# EAGLE design battery_monitor (EAGLE 7.3.0)
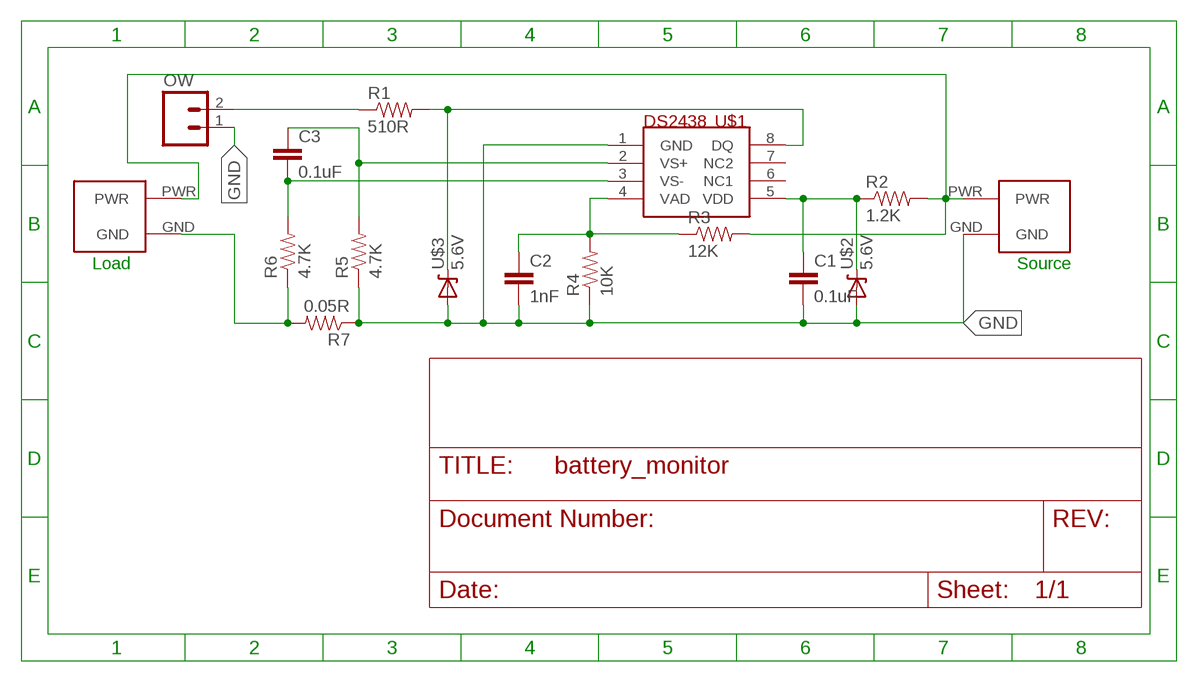
[diagram p0: schematic, sheet 1]

## Parts
C1  0.1uF  CAP0805  [0805]
C2  1nF  CAP0805  [0805]
C3  0.1uF  CAP0805  [0805]
LOAD  AND_PWR  [AND_PWR]
OW  M02POLAR_LOCK  [MOLEX-1X2_LOCK]
R1  510R  RESISTOR0805-RES  [0805]
R2  1.2K  RESISTOR0805-RES  [0805]
R3  12K  RESISTOR0805-RES  [0805]
R4  10K  RESISTOR0805-RES  [0805]
R5  4.7K  RESISTOR0805-RES  [0805]
R6  4.7K  RESISTOR0805-RES  [0805]
R7  0.05R  RESISTOR1206  [1206]
SOURCE  AND_PWR  [AND_PWR]
U$1  DS2438Z  [SOIC8]
U$2  5.6V  DIODE-ZENERSMB  [SMB-DIODE]
U$3  5.6V  DIODE-ZENERSMB  [SMB-DIODE]

## Nets
GND: C1.2 C2.2 OW.1 R4.1 R5.1 R7.1 SOURCE.GND U$1.1(GND) U$2.A U$3.A
N$1: C1.1 R2.1 U$1.5(VDD) U$2.C
N$4: C3.2 R6.2 U$1.3(VS-)
N$5: C2.1 R3.1 R4.2 U$1.4(VAD)
N$6: OW.2 R1.1
N$8: R1.2 U$1.8(DQ) U$3.C
N$10: LOAD.GND R6.1 R7.2
N$13: C3.1 R5.2 U$1.2(VS+)
PWR: LOAD.PWR R2.2 R3.2 SOURCE.PWR
Unconnected: U$1.6(NC1) U$1.7(NC2)

## Notes on the sheet
- Load | Source

## Library data of the parts
C1-C3 = SparkFun:CAP: Capacitor Standard 0603 ceramic capacitor, and 0.1" leaded capacitor.
LOAD SOURCE = ARVP:AND_PWR
OW = SparkFun:M02: Header 2 Standard 2-pin 0.1" header. Use with straight break away headers (SKU : PRT-00116), right angle break away headers (PRT-00553), swiss pins (PRT-00743), machine pins (PRT-00117), and female headers (PRT-00115). Molex polarized connector foot print use with SKU : PRT-08233 with associated crimp pins and housings.
R1-R7 = SparkFun:RESISTOR: Resistor Basic schematic elements and footprints for 0603, 1206, and PTH resistors.
U$1 = ARVP:DS2438
U$2 U$3 = SparkFun:DIODE-ZENER: Zener Diode Production Part - 8199 3.4V Zener Voltage

## Board
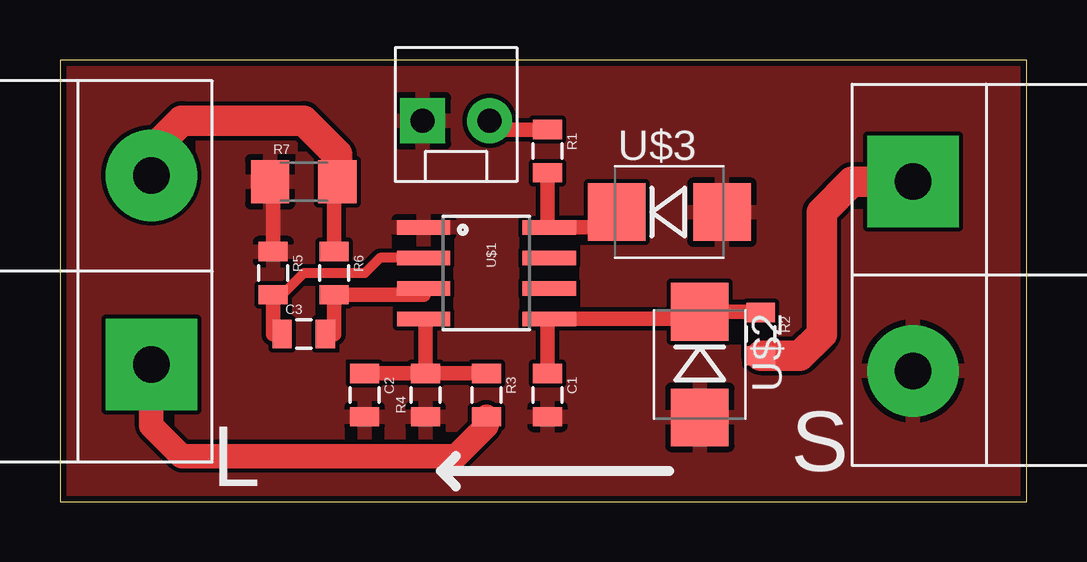
[diagram p1: board, top side]
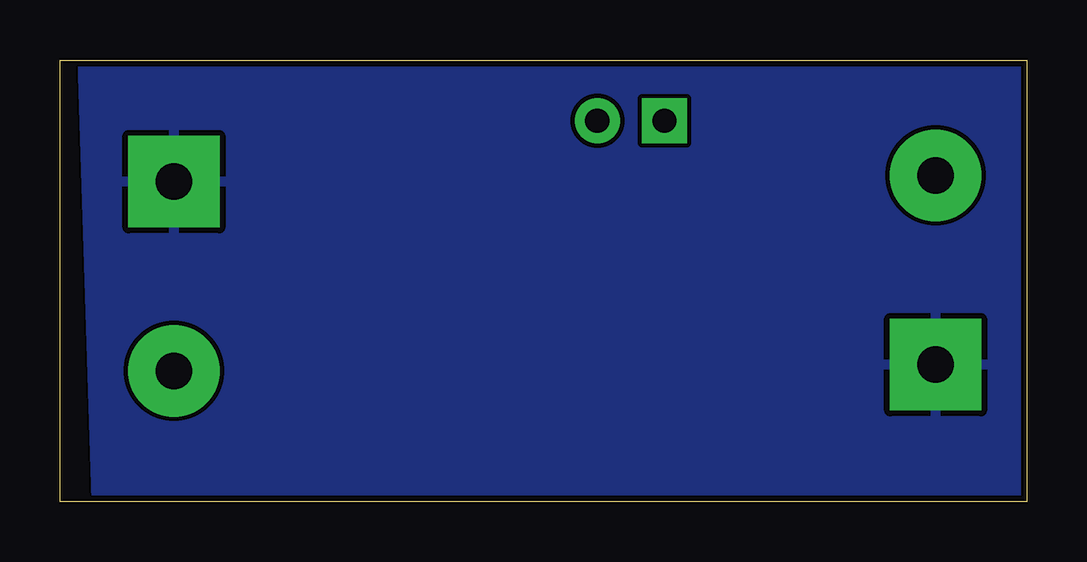
[diagram p2: board, bottom side, seen from below]

Size 40.31 x 18.41 mm. Coordinates in mm from the lower left corner, seen from the top.
Outline: 0,0 40.31,0 40.31,18.41 0,18.41 0,0
Copper layers (1*16): Top 0.035mm / dielectric 1.5mm / Bottom 0.035mm
Design rules "apcircuits": minimum track width 0.18mm, minimum drill 20mil, track to track 0.18mm, track to pad 0.18mm, pad to pad 0.18mm, via to via 0.18mm, smd to smd 0.18mm, copper to edge 0.25mm, drill to drill 0.25mm, minimum pad ring 10mil, minimum via ring 8mil, stop-mask expansion 4mil, vias tented up to drill 0mil, thermal gap 10mil

### Footprints (pad centres in the part's own frame; a part is rotated, then mirrored left to right if it is on the bottom)
0805 = smd 0.8 x 1.2: 1 -0.9,0; 2 0.9,0
AND_PWR = drill 1.524 pad 3.81: GND 0,-7.886 | drill 1.524 pad 3.81 square: PWR 0,0
MOLEX-1X2_LOCK = drill 1.016 pad 1.88 square: 1 -0.127,0 | drill 1.016 pad 1.88: 2 2.667,0
1206 = smd 1.6 x 1.8: 1 -1.4,0; 2 1.4,0
SOIC8 = smd 0.61 x 2.21: 1 -1.905,-2.616; 2 -0.635,-2.616; 3 0.635,-2.616; 4 1.905,-2.616; 5 1.905,2.616; 6 0.635,2.616; 7 -0.635,2.616; 8 -1.905,2.616
SMB-DIODE = smd 2.4 x 2.4: A 2.2,0; C -2.2,0

### Placement (x,y rotation side)
C1  20.32,4.45 270 top
C2  12.7,4.45 270 top
C3  10.16,6.98 0 top
LOAD  3.81,5.71 180 top
OW  15.24,15.88 0 top
R1  20.32,14.61 270 top
R2  29.21,6.98 270 top
R3  17.78,4.45 270 top
R4  15.24,4.45 90 top
R5  8.89,9.53 270 top
R6  11.43,9.53 270 top
R7  10.16,13.33 0 top
SOURCE  35.56,13.33 0 top
U$1  17.78,9.53 270 top
U$2  26.67,5.71 270 top
U$3  25.4,12.06 0 top

### Tracks (layer width: path | path; a pad name or v marks a point on that pad's centre or on a via)
GND
  Top 0.61: 8.89,13.33 R5.1
  pour Top: 0,18.42 59.69,18.42 59.05,-1.27 -0.64,-1.27
N$1
  Top 0.61: C1.1 20.32,7.54 U$1.5 26.38,7.62 U$2.C 29.18,7.92 R2.1
N$4
  Top 0.61: C3.2 11.43,6.98 R6.2 15.16,8.62 U$1.3
N$5
  Top 0.61: C2.1 R4.2 | R4.2 15.24,7.54 U$1.4 | R3.1 R4.2
N$6
  Top 0.61: R1.1 18.28,15.5 OW.2
N$8
  Top 0.61: U$3.C 22.57,11.43 U$1.8 20.32,11.51 R1.2
N$10
  Top 0.61: R7.2 11.43,13.33 R6.1
  Top 1.27: LOAD.GND 3.81,14.61 5.08,15.88 10.16,15.88 11.56,14.47 R7.2
N$13
  Top 0.406: R5.2 9.26,8.62 10.16,9.53 12.7,9.53 13.34,10.16 U$1.2
  Top 0.61: C3.1 8.89,6.98 R5.2
PWR
  Top 1.016: R3.2 17.78,3.17 16.51,1.91 5.08,1.91 3.81,3.17 LOAD.PWR
  Top 1.27: R2.2 30.85,6.08 31.75,6.98 31.75,12.06 33.02,13.33 SOURCE.PWR
  pour Bottom: 0,18.42 -0.64,-1.27 38.73,-1.27 39.37,18.42

### Text on the board
tPlace: S | L